# EAGLE design jongwoo (EAGLE 5.12)
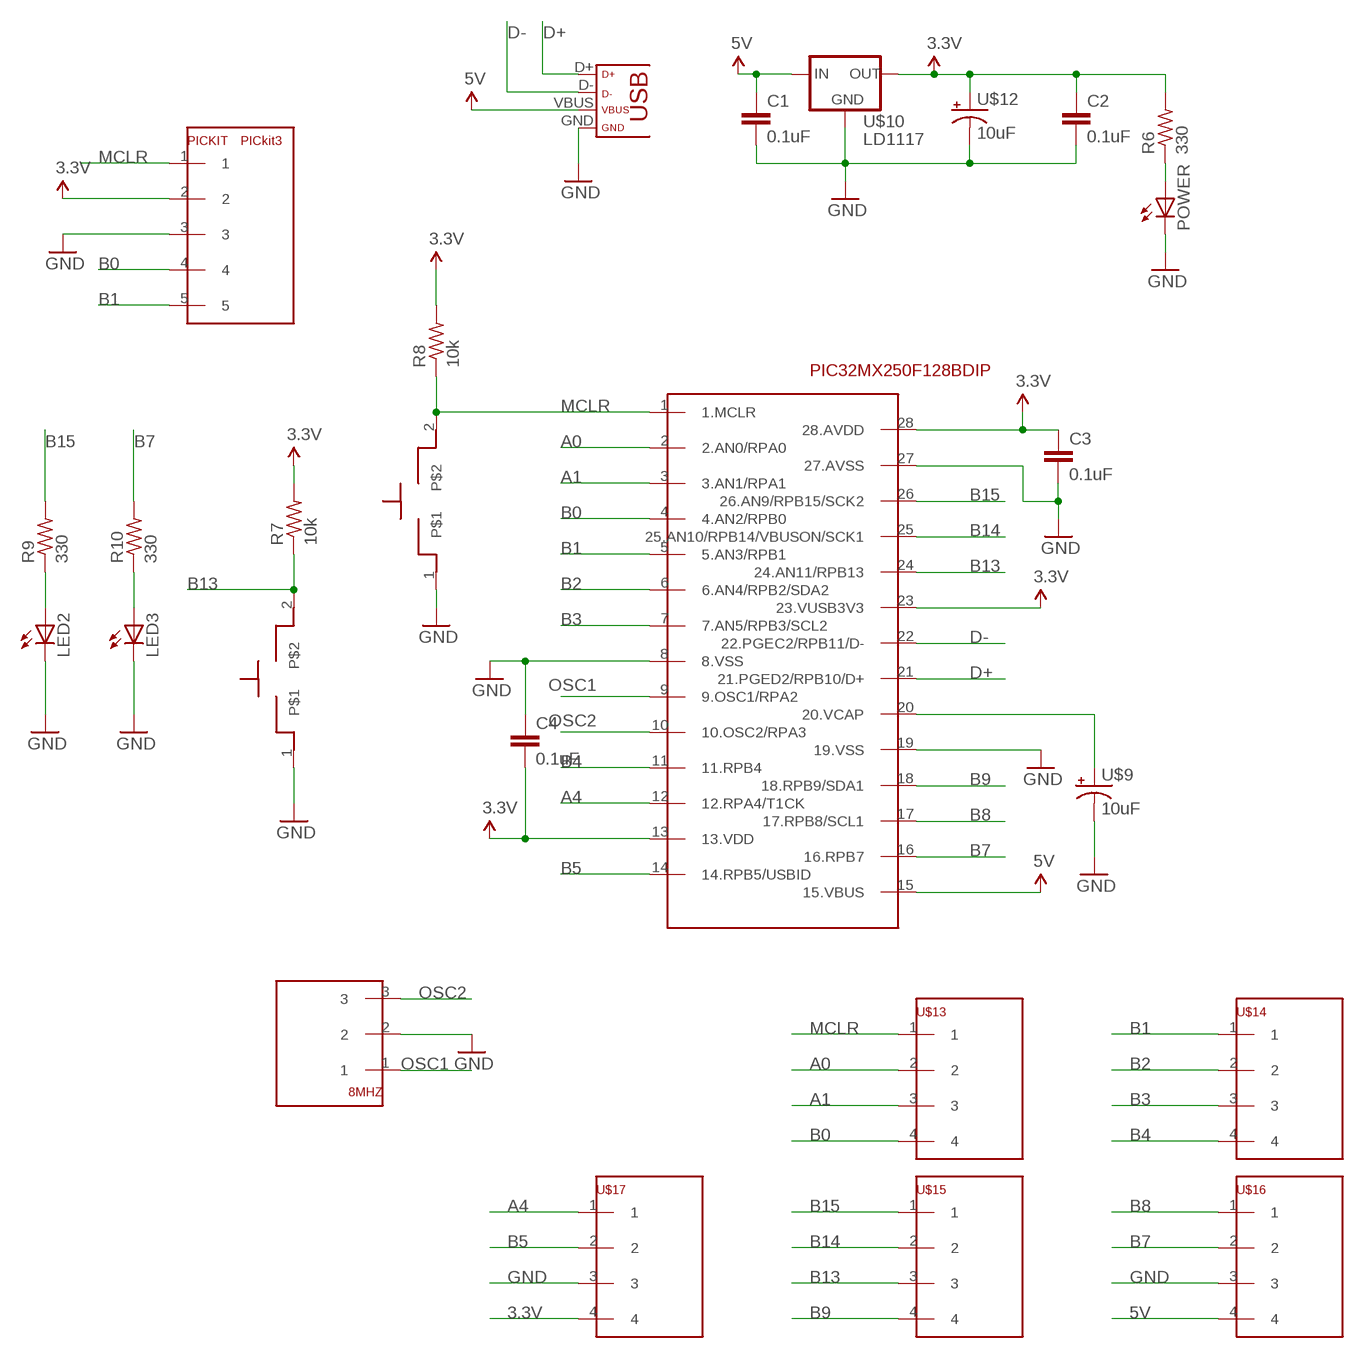
[diagram p0: schematic, sheet 1]

## Parts
8MHZ  1X03_HEADER  [1X03]
C1  0.1uF  C-EU025-030X050  [C025-030X050]
C2  0.1uF  C-EU025-030X050  [C025-030X050]
C3  0.1uF  C-EU025-030X050  [C025-030X050]
C4  0.1uF  C-EU025-030X050  [C025-030X050]
LED2  LED3MM  [LED3MM]
LED3  LED3MM  [LED3MM]
PIC32MX250F128BDIP  PIC32  [DIL28-3]
PICKIT  PICkit3  1X05_HEADER  [1X05]
POWER  LED3MM  [LED3MM]
R6  330  R-US_0204/7  [0204/7]
R7  10k  R-US_0204/7  [0204/7]
R8  10k  R-US_0204/7  [0204/7]
R9  330  R-US_0204/7  [0204/7]
R10  330  R-US_0204/7  [0204/7]
U$3  RESET  BUTTON  [1X02]
U$4  USB  [USB-MINIB]
U$6  USER  BUTTON  [1X02]
U$9  10uF  CAP_POL  [CAP_POL_D]
U$10  LD1117  [TO220]
U$12  10uF  CAP_POL  [CAP_POL_D]
U$13  1X04_HEADER  [1X04]
U$14  1X04_HEADER  [1X04]
U$15  1X04_HEADER  [1X04]
U$16  1X04_HEADER  [1X04]
U$17  1X04_HEADER  [1X04]

## Nets
3.3V: C2.1 C3.1 C4.2 PIC32MX250F128BDIP.13(13.VDD) PIC32MX250F128BDIP.23(23.VUSB3V3) PIC32MX250F128BDIP.28(28.AVDD) PICKIT.2 R6.2 R7.2 R8.2 U$10.2(OUT) U$12.1(+) U$17.4
5V: C1.1 PIC32MX250F128BDIP.15(15.VBUS) U$4.VBUS U$10.3(IN) U$16.4
A0: PIC32MX250F128BDIP.2(2.AN0/RPA0) U$13.2
A1: PIC32MX250F128BDIP.3(3.AN1/RPA1) U$13.3
A4: PIC32MX250F128BDIP.12(12.RPA4/T1CK) U$17.1
B0: PIC32MX250F128BDIP.4(4.AN2/RPB0) PICKIT.4 U$13.4
B1: PIC32MX250F128BDIP.5(5.AN3/RPB1) PICKIT.5 U$14.1
B2: PIC32MX250F128BDIP.6(6.AN4/RPB2/SDA2) U$14.2
B3: PIC32MX250F128BDIP.7(7.AN5/RPB3/SCL2) U$14.3
B4: PIC32MX250F128BDIP.11(11.RPB4) U$14.4
B5: PIC32MX250F128BDIP.14(14.RPB5/USBID) U$17.2
B7: PIC32MX250F128BDIP.16(16.RPB7) R10.2 U$16.2
B8: PIC32MX250F128BDIP.17(17.RPB8/SCL1) U$16.1
B9: PIC32MX250F128BDIP.18(18.RPB9/SDA1) U$15.4
B13: PIC32MX250F128BDIP.24(24.AN11/RPB13) R7.1 U$6.2 U$15.3
B14: PIC32MX250F128BDIP.25(25.AN10/RPB14/VBUSON/SCK1) U$15.2
B15: PIC32MX250F128BDIP.26(26.AN9/RPB15/SCK2) R9.2 U$15.1
D+: PIC32MX250F128BDIP.21(21.PGED2/RPB10/D+) U$4.D+
D-: PIC32MX250F128BDIP.22(22.PGEC2/RPB11/D-) U$4.D-
GND: 8MHZ.2 C1.2 C2.2 C3.2 C4.1 LED2.K(C) LED3.K(C) PIC32MX250F128BDIP.8(8.VSS) PIC32MX250F128BDIP.19(19.VSS) PIC32MX250F128BDIP.27(27.AVSS) PICKIT.3 POWER.K(C) U$3.1 U$4.GND U$6.1 U$9.2(-) U$10.1(GND) U$12.2(-) U$16.3 U$17.3
MCLR: PIC32MX250F128BDIP.1(1.MCLR) PICKIT.1 R8.1 U$3.2 U$13.1
N$4: LED3.A R10.1
N$5: LED2.A R9.1
N$6: PIC32MX250F128BDIP.20(20.VCAP) U$9.1(+)
N$7: POWER.A R6.1
OSC1: 8MHZ.1 PIC32MX250F128BDIP.9(9.OSC1/RPA2)
OSC2: 8MHZ.3 PIC32MX250F128BDIP.10(10.OSC2/RPA3)

## Library data of the parts
8MHZ = ME433:1X03_HEADER
C1-C4 = resistor:C-EU: CAPACITOR, European symbol
LED2 LED3 POWER = ME433:LED: LED OSRAM: - CHIPLED LG R971, LG N971, LY N971, LG Q971, LY Q971, LO R971, LY R971 LH N974, LH R974 LS Q976, LO Q976, LY Q976 LO Q996 - Hyper CHIPLED LW Q18S LB Q993, LB Q99A, LB R99A - SideLED LS A670, LO A670, LY A670, LG A670, LP A670 LB A673, LV A673, LT A673, LW A673 LH A674 LY A675 LS A676, LA A676, LO A676, LY A676, LW A676 LS A679, LY A679, LG A679 - Hyper Micro SIDELED® LS Y876, LA Y876, LO Y876, LY Y876 LT Y87S - SmartLED LW L88C, LW L88S LB L89C, LB L89S, LG L890 LS L89K, LO L89K, LY L89K LS L896, LA L896, LO L896, LY L896 - TOPLED LS T670, LO T670, LY T670, LG T670, LP T670 LSG T670, LSP T670, LSY T670, LOP T670, LYG T670 LG T671, LOG T671, LSG T671 LB T673, LV T673, LT T673, LW T673 LH T674 LS T676, LA T676, LO T676, LY T676, LB T676, LH T676, LSB T676, LW T676 LB T67C, LV T67C, LT T67C, LS T67K, LO T67K, LY T67K, LW E67C LS E67B, LA E67B, LO E67B, LY E67B, LB E67C, LV E67C, LT E67C LW T67C LS T679, LY T679, LG T679 LS T770, LO T770, LY T770, LG T770, LP T770 LB T773, LV T773, LT T773, LW T773 LH T774 LS E675, LA E675, LY E675, LS T675 LS T776, LA T776, LO T776, LY T776, LB T776 LHGB T686 LT T68C, LB T68C - Hyper Mini TOPLED® LB M676 - Mini TOPLED Santana® LG M470 LS M47K, LO M47K, LY M47K Source: http://www.osram.convergy.de LUXEON: - LUMILED® LXK2-PW12-R00, LXK2-PW12-S00, LXK2-PW14-U00, LXK2-PW14-V00 LXK2-PM12-R00, LXK2-PM12-S00, LXK2-PM14-U00 LXK2-PE12-Q00, LXK2-PE12-R00, LXK2-PE12-S00, LXK2-PE14-T00, LXK2-PE14-U00 LXK2-PB12-K00, LXK2-PB12-L00, LXK2-PB12-M00, LXK2-PB14-N00, LXK2-PB14-P00, LXK2-PB14-Q00 LXK2-PR12-L00, LXK2-PR12-M00, LXK2-PR14-Q00, LXK2-PR14-R00 LXK2-PD12-Q00, LXK2-PD12-R00, LXK2-PD12-S00 LXK2-PH12-R00, LXK2-PH12-S00 LXK2-PL12-P00, LXK2-PL12-Q00, LXK2-PL12-R00 Source: www.luxeon.com KINGBRIGHT: KA-3528ASYC Source: www.kingbright.com
PIC32MX250F128BDIP = ME433:PIC32
PICKIT = ME433:1X05_HEADER
R6-R10 = ME433:R-US_: RESISTOR, American symbol
U$3 U$6 = ME433:BUTTON
U$4 = ME433:USB
U$9 U$12 = ME433:CAP_POL
U$10 = ME433:LD1117
U$13-U$17 = ME433:1X04_HEADER

## Board
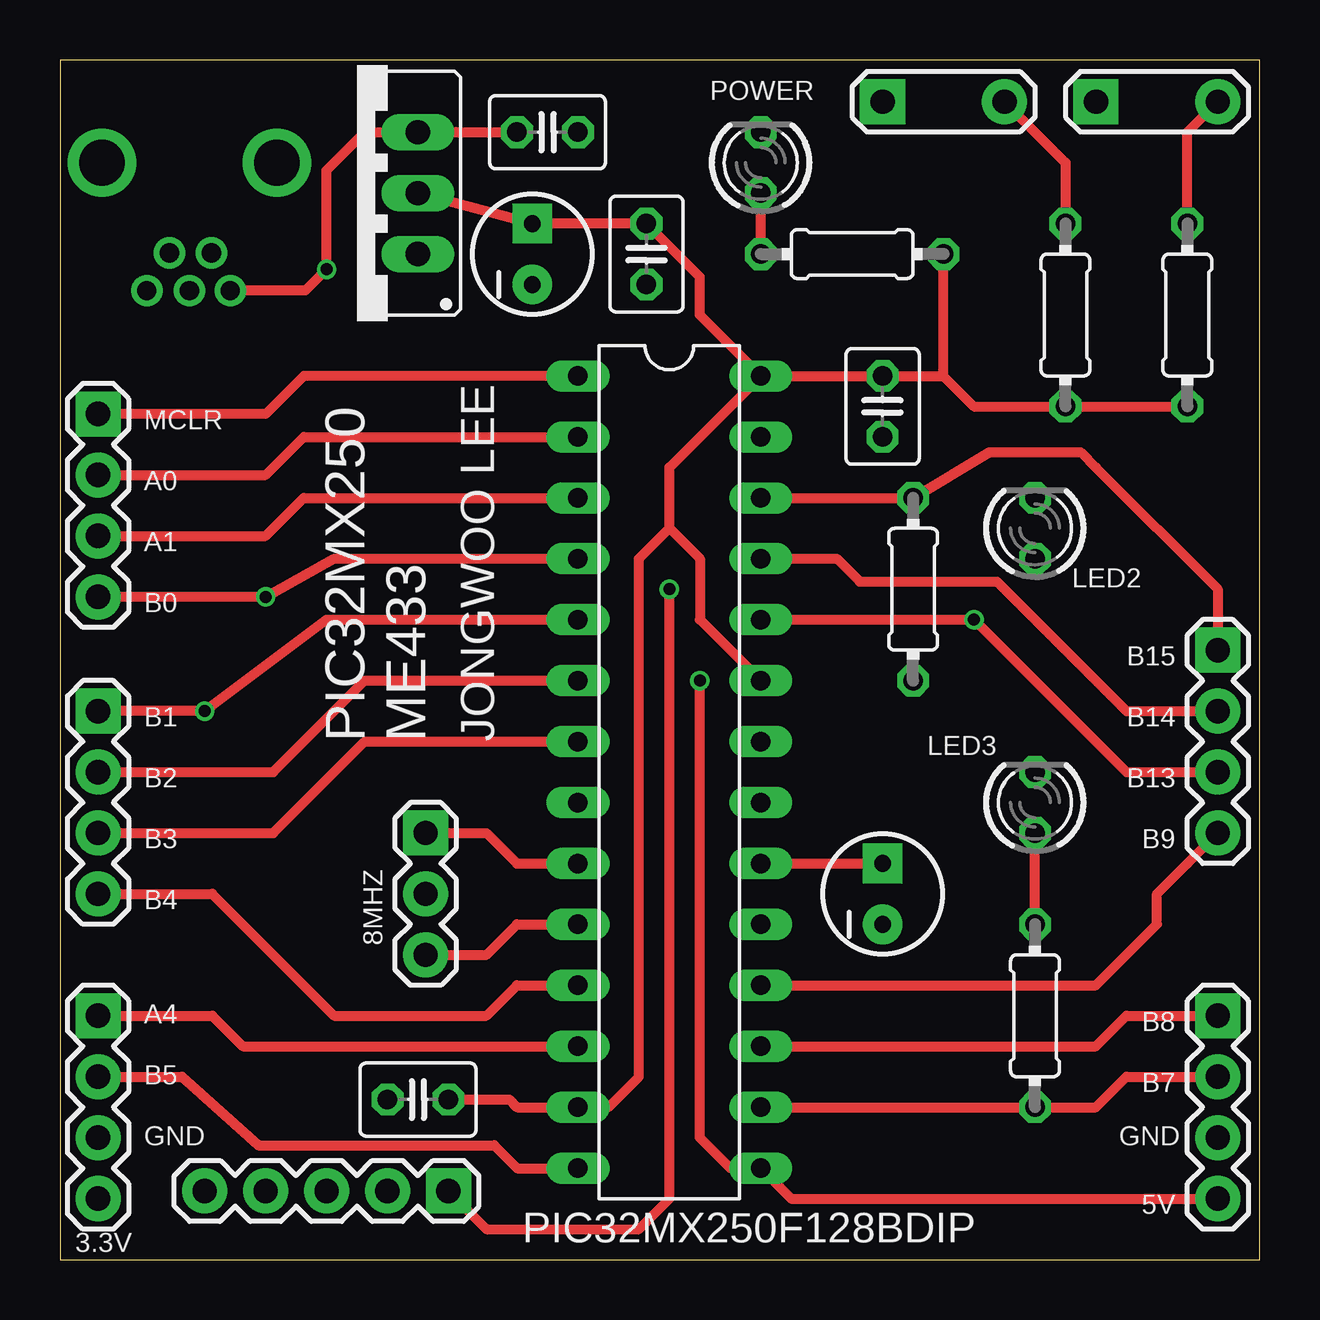
[diagram p1: board, top side]
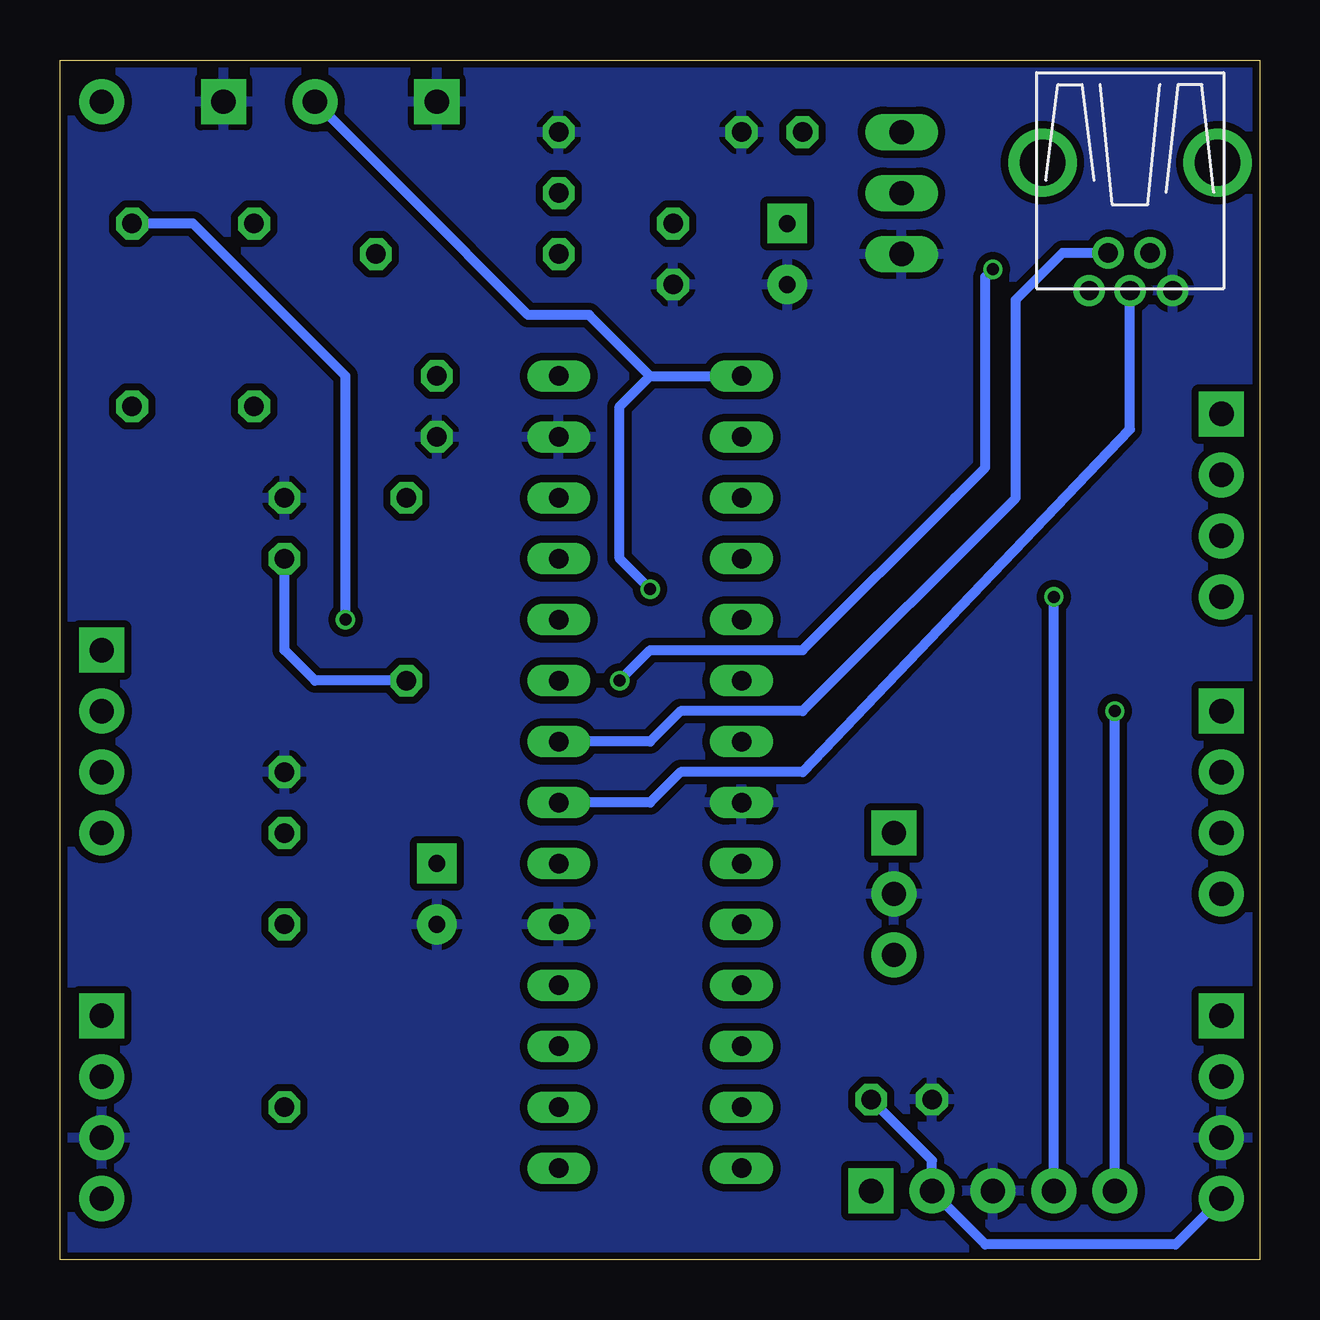
[diagram p2: board, bottom side, seen from below]

Size 50 x 50 mm. Coordinates in mm from the lower left corner, seen from the top.
Outline: 0,0 50,0 50,50 0,50 0,0
Copper layers (1*16): Top 0.035mm / dielectric 1.5mm / Bottom 0.035mm
Design rules "SeeedStudio_2layer_DRU_no_angle_20140221": minimum track width 6mil, minimum drill 12mil, track to track 6mil, track to pad 6mil, pad to pad 6mil, via to via 6mil, smd to smd 0mil, copper to edge 10mil, drill to drill 10mil, minimum pad ring 10mil, minimum via ring 6mil, stop-mask expansion 2mil, vias tented up to drill 100mil, thermal gap 10mil

### Footprints (pad centres in the part's own frame; a part is rotated, then mirrored left to right if it is on the bottom)
1X03 = drill 1.016 pad 1.88 square: 1 0,0 | drill 1.016 pad 1.88 round: 2 2.54,0; 3 5.08,0
C025-030X050 = drill 0.813 octagon: 1 -1.27,0; 2 1.27,0
LED3MM = drill 0.813 octagon: A -1.27,0; K 1.27,0
DIL28-3 = drill 0.813 long: 1 -16.51,-3.81; 2 -13.97,-3.81; 3 -11.43,-3.81; 4 -8.89,-3.81; 5 -6.35,-3.81; 6 -3.81,-3.81; 7 -1.27,-3.81; 8 1.27,-3.81; 9 3.81,-3.81; 10 6.35,-3.81; 11 8.89,-3.81; 12 11.43,-3.81; 13 13.97,-3.81; 14 16.51,-3.81; 15 16.51,3.81; 16 13.97,3.81; 17 11.43,3.81; 18 8.89,3.81; 19 6.35,3.81; 20 3.81,3.81; 21 1.27,3.81; 22 -1.27,3.81; 23 -3.81,3.81; 24 -6.35,3.81; 25 -8.89,3.81; 26 -11.43,3.81; 27 -13.97,3.81; 28 -16.51,3.81
1X05 = drill 1.016 pad 1.88 square: 1 0,0 | drill 1.016 pad 1.88 round: 2 2.54,0; 3 5.08,0; 4 7.62,0; 5 10.16,0
0204/7 = drill 0.813 octagon: 1 -3.81,0; 2 3.81,0
1X02 = drill 1.016 pad 1.88 square: 1 0,0 | drill 1.016 pad 1.88 round: 2 5.08,0
USB-MINIB = drill 0.8 round: D+ 4.064,0; D- 2.489,0.914; GND 4.064,-1.778; ID 2.489,-0.838; VBUS 4.064,1.702 | drill 1.9 round: P$6 -1.27,-3.65; P$7 -1.27,3.65
CAP_POL_D = drill 0.7 pad 1.651 square: 1 1.27,0 | drill 0.7 pad 1.651 round: 2 -1.27,0
TO220 = drill 1.016 long: 1 -2.54,0; 2 0,0; 3 2.54,0
1X04 = drill 1.016 pad 1.88 square: 1 0,0 | drill 1.016 pad 1.88 round: 2 2.54,0; 3 5.08,0; 4 7.62,0

### Placement (x,y rotation side)
8MHZ  15.24,17.78 270 top
C1  20.32,46.99 0 top
C2  24.45,41.91 270 top
C3  34.29,35.56 270 top
C4  14.92,6.67 0 top
LED2  40.64,30.48 90 top
LED3  40.64,19.05 90 top
PIC32MX250F128BDIP  25.4,20.32 270 top
PICKIT  16.19,2.86 180 top
POWER  29.21,45.72 90 top
R6  33.02,41.91 0 top
R7  46.99,39.37 270 top
R8  41.91,39.37 270 top
R9  35.56,27.94 90 top
R10  40.64,10.16 270 top
U$3  34.29,48.26 0 top
U$4  5.4,44.45 270 top
U$6  43.18,48.26 0 top
U$9  34.29,15.24 90 top
U$10  14.92,44.45 90 top
U$12  19.68,41.91 90 top
U$13  1.59,35.24 270 top
U$14  1.59,22.86 270 top
U$15  48.26,25.4 270 top
U$16  48.26,10.16 270 top
U$17  1.59,10.16 270 top

### Tracks (layer width: path | path; a pad name or v marks a point on that pad's centre or on a via)
3.3V
  Top 0.406: C4.2 18.73,6.67 19.05,6.35 PIC32MX250F128BDIP.13 22.86,6.35 24.13,7.62 24.13,8.89 24.13,29.21 25.4,30.48 | PIC32MX250F128BDIP.28 C3.1 36.83,36.83 | 36.83,36.83 38.1,35.56 R8.2 R7.2 | 36.83,36.83 R6.2 | U$10.2 U$12.1 C2.1 26.67,40.96 26.67,39.37 | PIC32MX250F128BDIP.28 26.67,39.37 | PIC32MX250F128BDIP.28 26.67,39.37 | PIC32MX250F128BDIP.23 26.67,26.67 26.67,29.21 25.4,30.48 | 25.4,30.48 25.4,33.02 PIC32MX250F128BDIP.28
  Bottom 0.406: U$17.4 3.49,0.64 11.43,0.64 PICKIT.2 13.65,4.13 C4.2
5V  (via drill 0.5)
  Top 0.406: U$16.4 30.48,2.54 PIC32MX250F128BDIP.15 27.94,3.81 26.67,5.08 v26.67,24.13 | C1.1 16.51,46.99 U$10.3 12.7,46.99 11.11,45.4 v11.11,41.27 10.22,40.39 U$4.VBUS
  Bottom 0.406: v26.67,24.13 25.4,25.4 19.05,25.4 12.7,31.75 11.43,33.02 11.43,38.1 11.43,39.37 11.43,40.96 v11.11,41.27
A0
  Top 0.406: U$13.2 8.57,32.7 10.16,34.29 PIC32MX250F128BDIP.2
A1
  Top 0.406: U$13.3 8.57,30.16 10.16,31.75 PIC32MX250F128BDIP.3
A4
  Top 0.406: U$17.1 6.35,10.16 7.62,8.89 PIC32MX250F128BDIP.12
B0  (via drill 0.5)
  Top 0.406: U$13.4 v8.57,27.62 11.43,29.21 PIC32MX250F128BDIP.4
  Bottom 0.406: PICKIT.4 v8.57,27.62
B1  (via drill 0.5)
  Top 0.406: U$14.1 v6.03,22.86 11.11,26.67 PIC32MX250F128BDIP.5
  Bottom 0.406: PICKIT.5 v6.03,22.86
B2
  Top 0.406: U$14.2 8.89,20.32 12.7,24.13 PIC32MX250F128BDIP.6
B3
  Top 0.406: U$14.3 8.89,17.78 12.7,21.59 PIC32MX250F128BDIP.7
B4
  Top 0.406: PIC32MX250F128BDIP.11 19.05,11.43 17.78,10.16 11.43,10.16 6.35,15.24 U$14.4
B5
  Top 0.406: U$17.2 5.08,7.62 8.26,4.76 18.1,4.76 19.05,3.81 PIC32MX250F128BDIP.14
B7
  Top 0.406: PIC32MX250F128BDIP.16 R10.2 43.18,6.35 44.45,7.62 U$16.2
B8
  Top 0.406: PIC32MX250F128BDIP.17 43.18,8.89 44.45,10.16 U$16.1
B9
  Top 0.406: PIC32MX250F128BDIP.18 43.18,11.43 45.72,13.97 45.72,15.24 46.99,16.51 U$15.4
B13  (via drill 0.5)
  Top 0.406: R7.1 46.99,46.99 U$6.2 | PIC32MX250F128BDIP.24 v38.1,26.67 44.45,20.32 U$15.3
  Bottom 0.406: R7.1 44.45,43.18 38.1,36.83 v38.1,26.67
B14
  Top 0.406: PIC32MX250F128BDIP.25 32.38,29.21 33.34,28.26 39.05,28.26 44.45,22.86 U$15.2
B15
  Top 0.406: PIC32MX250F128BDIP.26 R9.2 38.73,33.66 42.55,33.66 43.18,33.02 48.26,27.94 U$15.1
D+
  Bottom 0.406: U$4.D+ 5.4,34.61 19.05,20.32 24.13,20.32 25.4,19.05 PIC32MX250F128BDIP.21
D-
  Bottom 0.406: U$4.D- 8.2,41.96 10.16,40.01 10.16,38.1 10.16,33.02 10.16,31.75 19.05,22.86 24.13,22.86 25.4,21.59 PIC32MX250F128BDIP.22
GND
  pour Bottom (isolate 0.305): 0,50.8 0,-1.27 50.8,-1.27 50.8,0 50.8,50.8
MCLR  (via drill 0.5)
  Top 0.406: U$13.1 8.57,35.24 10.16,36.83 PIC32MX250F128BDIP.1 | PICKIT.1 17.78,1.27 24.13,1.27 25.4,2.54 25.4,25.4 v25.4,27.94 | R8.1 41.91,45.72 U$3.2
  Bottom 0.406: v25.4,27.94 26.67,29.21 26.67,35.56 25.4,36.83 | 25.4,36.83 PIC32MX250F128BDIP.1 25.4,36.83 | 25.4,36.83 27.94,39.37 30.48,39.37 35.56,44.45 U$3.2
N$4
  Top 0.406: R10.1 LED3.A
N$5
  Bottom 0.406: R9.1 39.37,24.13 40.64,25.4 LED2.A
N$6
  Top 0.406: PIC32MX250F128BDIP.20 U$9.1
N$7
  Top 0.406: R6.1 POWER.A
OSC1
  Top 0.406: 8MHZ.1 17.78,17.78 19.05,16.51 PIC32MX250F128BDIP.9
OSC2
  Top 0.406: 8MHZ.3 17.78,12.7 19.05,13.97 PIC32MX250F128BDIP.10

### Text on the board
tPlace: MCLR | A0 | A1 | B0 | B15 | B1 | PIC32MX250 | ME433 | JONGWOO LEE | B14 | B2 | B13 | B3 | B9 | B4 | A4 | B8 | B5 | B7 | GND | GND | 5V | 3.3V